# EAGLE design camera_light_v1 (EAGLE 9.4.1)
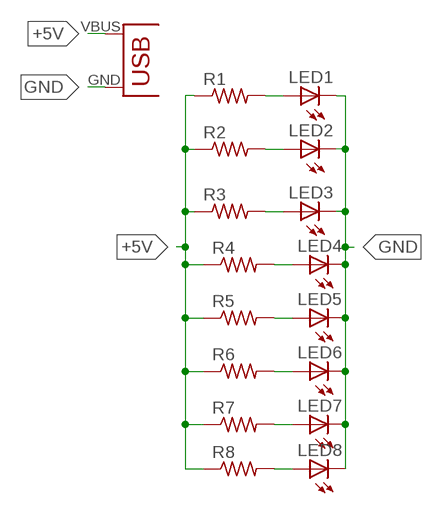
[diagram p0: schematic, sheet 1]

## Parts
LED1  LED1210  [EIA1210]
LED2  LED1210  [EIA1210]
LED3  LED1210  [EIA1210]
LED4  LED1210  [EIA1210]
LED5  LED1210  [EIA1210]
LED6  LED1210  [EIA1210]
LED7  LED1210  [EIA1210]
LED8  LED1210  [EIA1210]
R1  RESISTOR0805  [R0805]
R2  RESISTOR0805  [R0805]
R3  RESISTOR0805  [R0805]
R4  RESISTOR0805  [R0805]
R5  RESISTOR0805  [R0805]
R6  RESISTOR0805  [R0805]
R7  RESISTOR0805  [R0805]
R8  RESISTOR0805  [R0805]
U$1  USB(POWER)  [USB(POWER)]

## Nets
+5V: R1.1 R2.1 R3.1 R4.1 R5.1 R6.1 R7.1 R8.1 U$1.VBUS(VCC)
GND: LED1.CATHODE(C) LED2.CATHODE(C) LED3.CATHODE(C) LED4.CATHODE(C) LED5.CATHODE(C) LED6.CATHODE(C) LED7.CATHODE(C) LED8.CATHODE(C) U$1.GND
N$5: LED1.ANODE(A) R1.2
N$6: LED2.ANODE(A) R2.2
N$7: LED3.ANODE(A) R3.2
N$8: LED4.ANODE(A) R4.2
N$9: LED5.ANODE(A) R5.2
N$10: LED6.ANODE(A) R6.2
N$11: LED7.ANODE(A) R7.2
N$12: LED8.ANODE(A) R8.2

## Library data of the parts
LED1-LED8 = CEDT_JANUARY_2015_v5:LED
R1-R8 = CEDT_JANUARY_2015_v5:RESISTOR
U$1 = CEDT_JANUARY_2015_v5:USB(POWER)

## Board
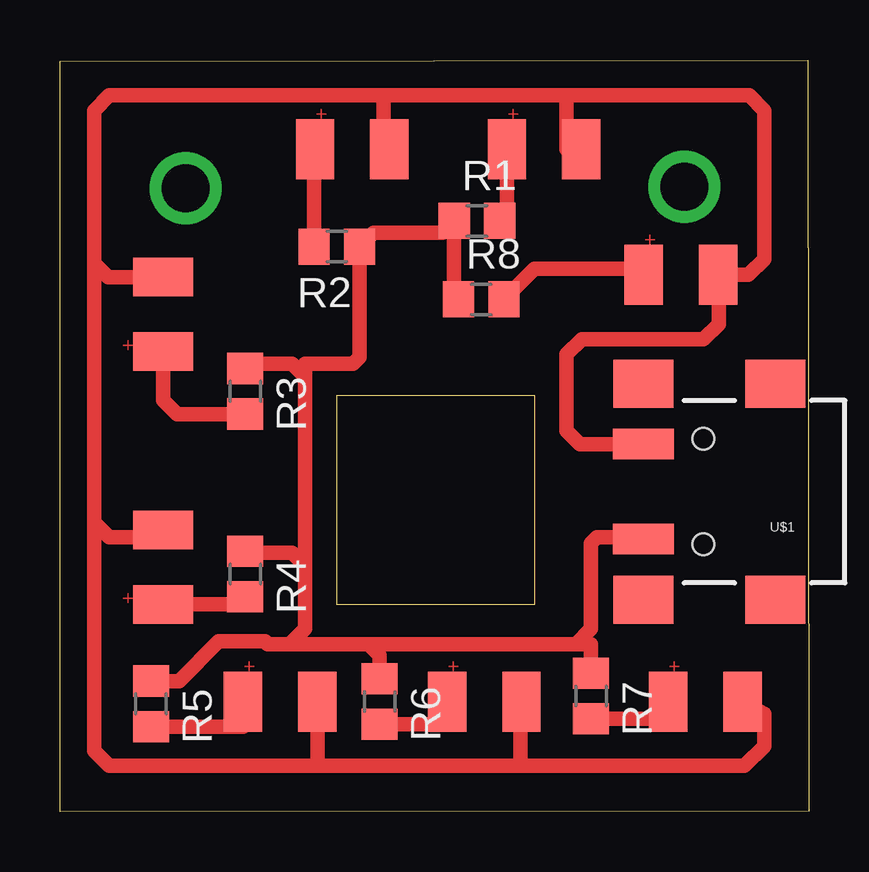
[diagram p1: board, top side]
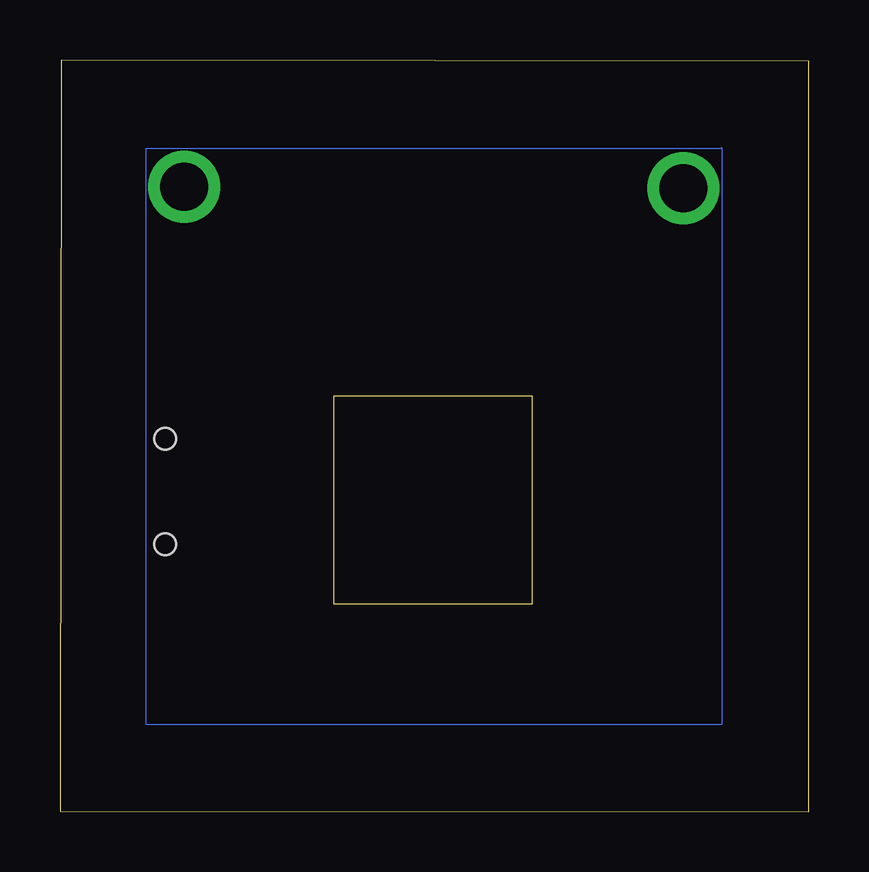
[diagram p2: board, bottom side, seen from below]

Size 31.22 x 31.32 mm. Coordinates in mm from the lower left corner, seen from the top.
Outline: 31.22,0.01 0,0 0,31.27 31.17,31.32 31.22,0.01
Outline: 19.8,8.63 19.8,17.34 11.54,17.34 11.54,8.63 19.8,8.63
Copper layers (1*16): Top 0.035mm / dielectric 1.5mm / Bottom 0.035mm
Design rules "default": minimum track width 6mil, minimum drill 0.35mm, track to track 6mil, track to pad 6mil, pad to pad 6mil, via to via 6mil, smd to smd 6mil, copper to edge 40mil, drill to drill 6mil, minimum pad ring 10mil, minimum via ring 8mil, stop-mask expansion 4mil, vias tented up to drill 0mil, thermal gap 10mil

### Footprints (pad centres in the part's own frame; a part is rotated, then mirrored left to right if it is on the bottom)
EIA1210 = smd 1.6 x 2.5: ANODE 1,0.6; CATHODE 4.1,0.6
R0805 = smd 1.3 x 1.5: 1 -0.95,0; 2 0.95,0
USB(POWER) = smd 2.54 x 1.27: GND 2.5,-1.981; VBUS 2.5,1.981 | smd 2.5 x 2: GND@1 -3,-4.5; GND@2 -3,4.5; GND@3 2.5,4.5; GND@4 2.5,-4.5 | hole 0.9: 0,2.2; 0,-2.2

### Placement (x,y rotation side)
LED1  17.64,27 0 top
LED2  9.63,27 0 top
LED3  4.91,18.18 90 top
LED4  4.91,7.63 90 top
LED5  6.63,3.98 0 top
LED6  15.14,3.98 0 top
LED7  24.35,3.98 0 top
LED8  23.34,21.77 0 top
R1  17.39,24.61 0 top
R2  11.54,23.55 180 top
R3  7.72,17.52 270 top
R4  7.72,9.9 270 top
R5  3.8,4.5 270 top
R6  13.32,4.59 270 top
R7  22.14,4.82 270 top
R8  17.56,21.35 0 top
U$1  26.82,13.34 180 top

### Tracks (layer width: path | path; a pad name or v marks a point on that pad's centre or on a via)
+5V
  Top 0.61: R3.1 7.72,18.66 9.68,18.66 10.22,18.12 | 10.22,18.12 10.22,18.66 12.22,18.66 12.49,18.93 R2.1 13.07,24.13 15.95,24.13 R1.1 16.43,21.52 R8.1 | 10.22,18.12 10.22,10.26 | R4.1 7.72,10.79 9.68,10.79 10.22,10.26 | 10.22,10.26 10.22,7.62 9.68,7.08 9.68,6.99 | 9.68,6.99 12.86,6.99 | R6.1 13.32,6.51 12.86,6.99 | U$1.VBUS 24.25,11.43 22.38,11.43 22.14,11.19 22.14,7.62 21.5,6.99 | R7.1 22.14,6.99 21.5,6.99 | 21.5,6.99 12.86,6.99 | 9.68,6.99 8.66,6.99 8.55,7.1 6.62,7.1 4.96,5.45 R5.1
GND
  Top 0.61: LED4.CATHODE 4.3,11.43 2.06,11.43 1.42,12.06 | LED2.CATHODE 13.49,27.6 13.49,29.84 | 13.49,29.84 2.06,29.84 1.42,29.21 1.42,22.86 | LED1.CATHODE 21.11,27.6 21.11,29.84 | 21.11,29.84 13.49,29.84 | 21.11,29.84 28.73,29.84 29.37,29.21 29.37,23.02 28.71,22.36 LED8.CATHODE 27.46,22.34 27.46,20.32 26.82,19.68 21.75,19.68 21.12,19.05 21.12,15.88 21.68,15.32 U$1.GND | 19.21,1.91 28.54,1.91 29.37,2.73 29.37,4.09 LED7.CATHODE | 19.21,1.91 10.73,1.91 | LED5.CATHODE 10.73,1.91 | LED6.CATHODE 19.21,4.55 19.21,1.91 | 10.73,1.91 2.06,1.91 1.42,2.54 1.42,12.06 | 1.42,22.86 1.42,12.06 | LED3.CATHODE 2.01,22.27 1.42,22.86
N$1
  Bottom 0: 3.64,27.64 27.64,27.64 27.64,3.63 3.64,3.63 3.64,27.64 | 3.64,27.64 3.64,27.68
N$2  (via drill 2 pad 3)
  other vias: 26.04,26.04
N$3  (via drill 2 pad 3)
  other vias: 5.24,25.98
N$5
  Top 0.61: LED1.ANODE 18.64,24.91 R1.2
N$6
  Top 0.61: LED2.ANODE 10.59,27.6 R2.2
N$7
  Top 0.61: LED3.ANODE 4.3,17.14 4.88,16.57 R3.2
N$8
  Top 0.61: R4.2 7.72,8.63 LED4.ANODE
N$9
  Top 0.61: LED5.ANODE 7.63,3.54 R5.2
N$10
  Top 0.61: LED6.ANODE 16.14,3.64 R6.2
N$11
  Top 0.61: LED7.ANODE 24.64,3.87 R7.2
N$12
  Top 0.61: 24.34,21.55 LED8.ANODE 24.08,22.62 19.78,22.62 R8.2